# EAGLE design tsmp6000_breakout (EAGLE 8.7.0)
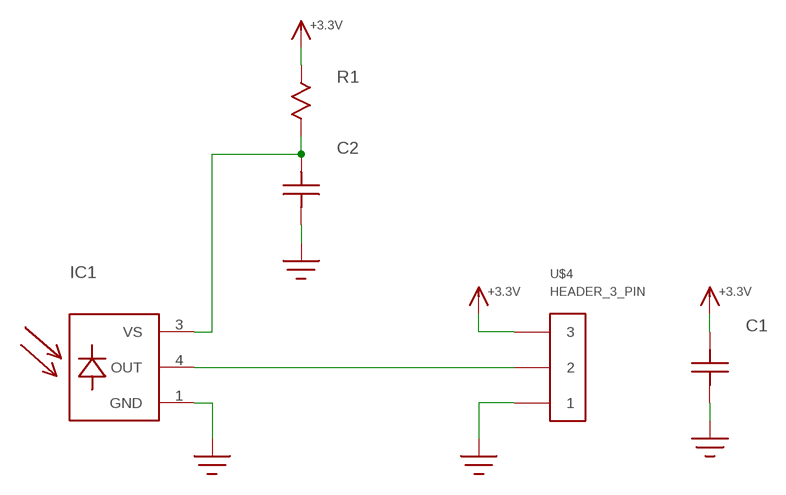
[diagram p0: schematic, sheet 1]

## Parts
C1  C1206  [1206]
C2  C0805  [0805]
IC1  TSMP6000  [TSMP6000]
R1  R0805  [R0805]
U$4  HEADER_3_PIN  [HEADER_3_PIN]

## Nets
+3.3V: C1.P$2 R1.P$1 U$4.3
GND: C1.P$1 C2.P$1 IC1.1(GND) U$4.1
N$3: C2.P$2 IC1.3(VS) R1.P$2
N$4: IC1.4(OUT) U$4.2

## Library data of the parts
C1 C2 = ssir:C
IC1 = ssir:TSMP6000
R1 = ssir:R
U$4 = ssir:HEADER_3_PIN

## Board
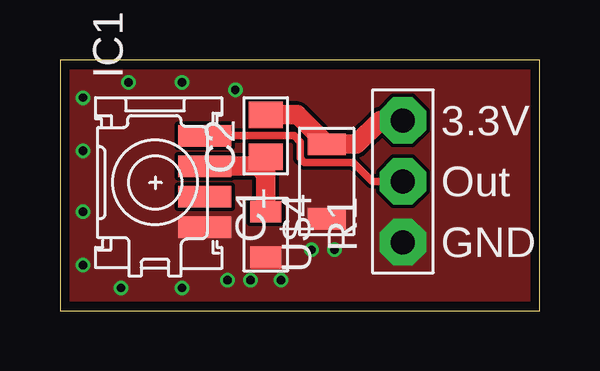
[diagram p1: board, top side]
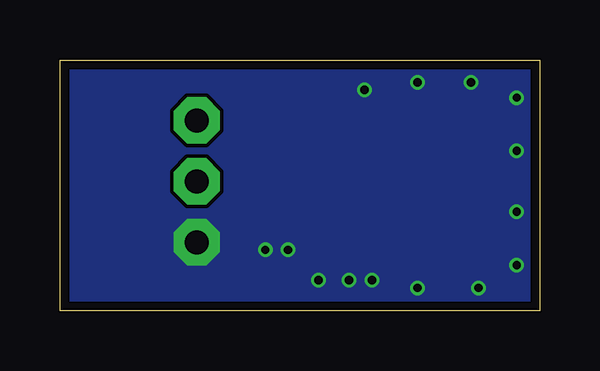
[diagram p2: board, bottom side, seen from below]

Size 19.98 x 10.46 mm. Coordinates in mm from the lower left corner, seen from the top.
Outline: 0,0 19.98,0 19.98,10.46 0,10.46 0,0
Copper layers (1*16): Top 0.035559375mm / dielectric 1.6mm / Bottom 0.035559375mm
Design rules "oshpark-2layer": minimum track width 6mil, minimum drill 10mil, track to track 6mil, track to pad 6mil, pad to pad 6mil, via to via 6mil, smd to smd 6mil, copper to edge 15mil, drill to drill 6mil, minimum pad ring 5mil, minimum via ring 5mil, stop-mask expansion 2.5mil, vias tented up to drill 0mil, thermal gap 10mil

### Footprints (pad centres in the part's own frame; a part is rotated, then mirrored left to right if it is on the bottom)
1206 = smd 0.9 x 1.6: P$1 -1.55,0; P$2 1.55,0
0805 = smd 0.9 x 1.3: P$1 -0.95,0; P$2 0.95,0
TSMP6000 = smd 0.9 x 2.2: 1 -1.905,0; 2 -0.635,0; 3 0.635,0; 4 1.905,0
R0805 = smd 1.1 x 1.4: P$1 -0.875,0; P$2 0.875,0
HEADER_3_PIN = drill 1 pad 1.93 octagon: 1 -2.54,0; 2 0,0; 3 2.54,0

### Placement (x,y rotation side)
C1  11.11,5.4 90 top
C2  8.57,3.17 90 top
IC1  6.03,5.4 90 top
R1  8.57,7.3 270 top
U$4  14.29,5.4 90 top

### Tracks (layer width: path | path; a pad name or v marks a point on that pad's centre or on a via)
+3.3V
  Top 0.813: U$4.3 13.34,7.94 12.35,6.95 C1.P$2 9.88,8.18 R1.P$1
GND  (via drill 0.35)
  other vias: 0.95,8.89 0.95,6.67 0.95,1.91 0.95,4.13 2.86,9.53 5.08,9.53 2.54,0.95 5.08,0.95 7.3,9.21 6.99,1.27 10.48,2.54 11.43,2.54 7.94,1.27 9.21,1.27
  pour Top (no thermals): 0,0 20,0 20,10.48 0,10.48
  pour Bottom (no thermals): 0,0 20,0 20,10.48 0,10.48
N$3
  Top 0.813: C2.P$2 8.57,5.71 | 8.57,5.71 R1.P$2 | IC1.3 8.26,6.03 8.57,5.71
N$4
  Top 0.305: IC1.4 9.75,7.3 10.01,7.05 10.01,6.37 10.19,6.19 12.22,6.19 13.02,5.4 U$4.2

### Text on the board
tPlace: 3.3V | Out | GND